# EasyEDA Pro project 0x2A.epro

# Schematic Schematic1
Create Date: 2023-12-21; Page Name: P1; Project Name: sensor_coil; Schematic Name: Schematic1; Update Date: 2024-07-09
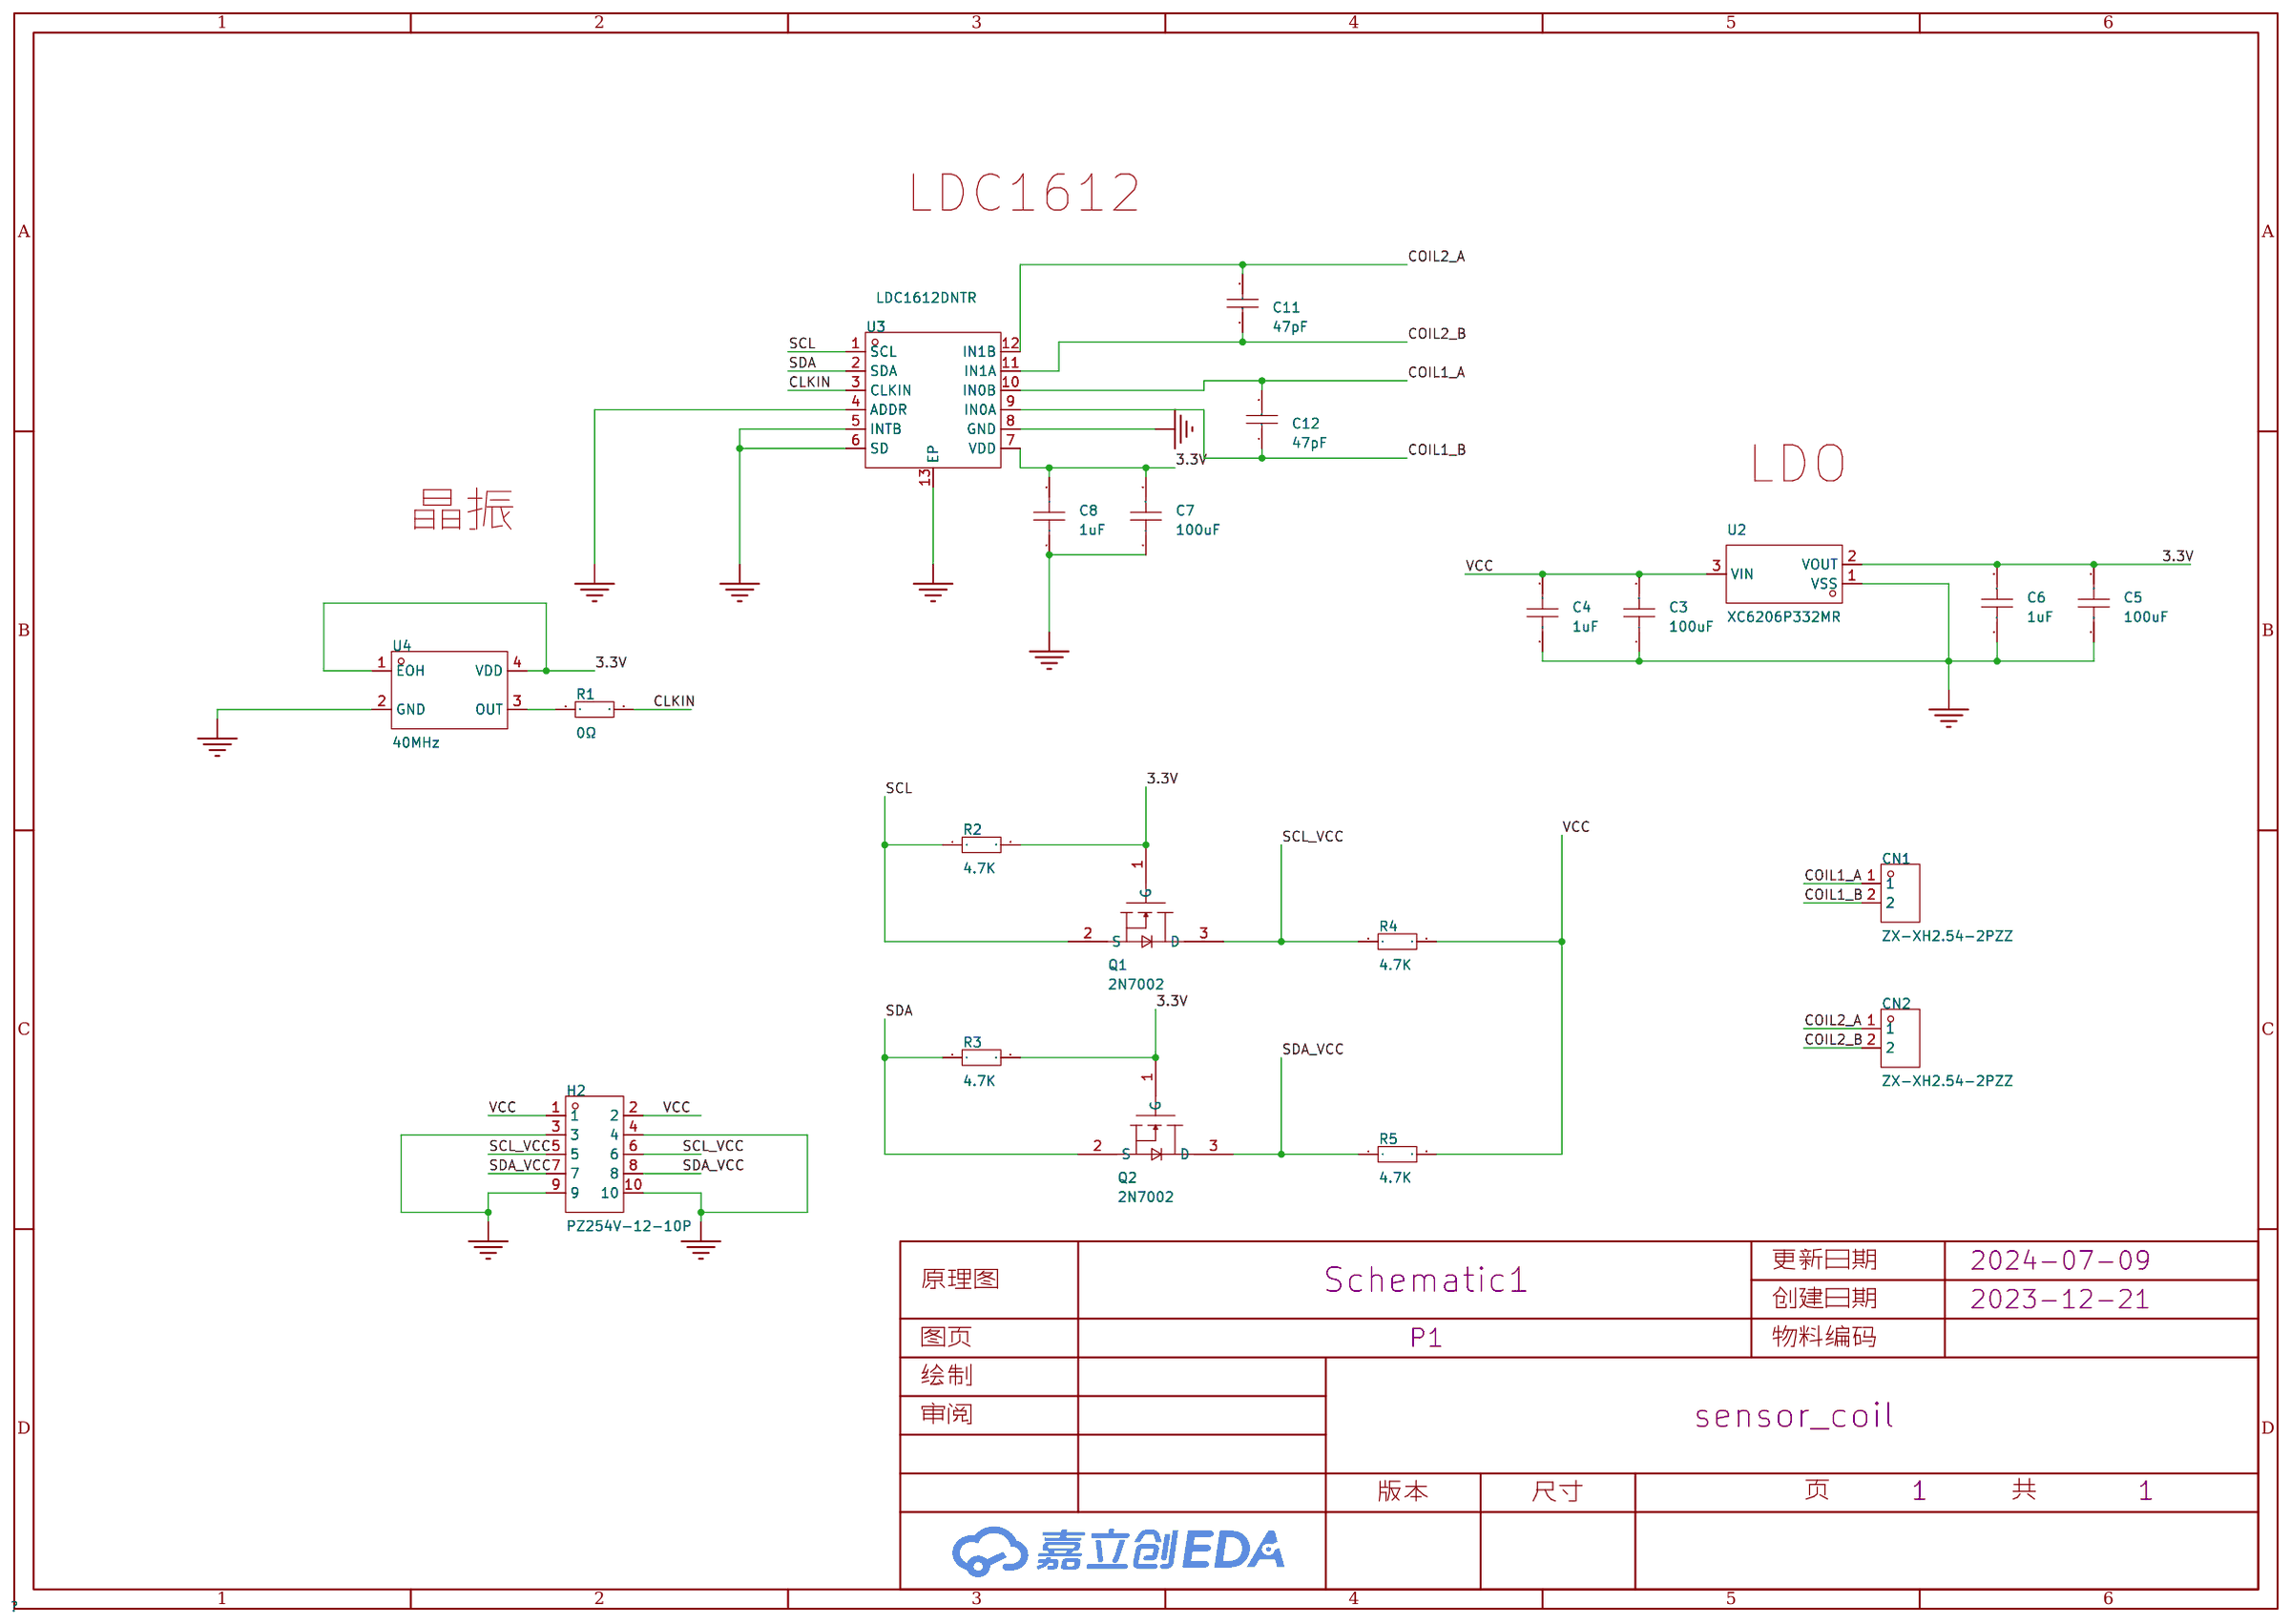
[diagram p0: schematic sheet]

## Parts
C3  100uF  [C0603]
C4  1uF  [C0603]
C5  100uF  [C0603]
C6  1uF  [C0603]
C7  100uF  [C0603]
C8  1uF  [C0603]
C11  47pF  [C0402]
C12  47pF  [C0402]
CN1  ZX-XH2.54-2PZZ  [CONN-TH_2P-P2.50_HX25003-2A]
CN2  ZX-XH2.54-2PZZ  [CONN-TH_2P-P2.50_HX25003-2A]
H2  PZ254V-12-10P  [HDR-TH_10P-P2.54-V-M-R2-C5-S2.54]
Q1  2N7002  [SOT-23-3_L2.9-W1.3-P1.90-LS2.4-BR]
Q2  2N7002  [SOT-23-3_L2.9-W1.3-P1.90-LS2.4-BR]
R1  0Ω  [R0603]
R2  4.7K  [R0603]
R3  4.7K  [R0603]
R4  4.7K  [R0603]
R5  4.7K  [R0603]
U2  XC6206P332MR  [SOT-23-3_L3.0-W1.7-P0.95-LS2.9-BR]
U3  LDC1612DNTR  [WSON-12_L4.0-W4.0-P0.50-BL-EP]
U4  40MHz  [OSC-SMD_4P-L2.5-W2.0-BL]

## Library data of the parts
C3-C8 = CAP_0603: Supplier Footprint: 0603
C11 C12 = 0402CG470J500NT: 容值:47pF;精度:±5%;额定电压:50V;材质(温度系数):C0G;; LCSC Part Name: 47pF ±5% 50V; Supplier Part: C1567; Manufacturer: FH(风华); Supplier Footprint: 0402; JLCPCB Part Class: 基础库; Datasheet: https://atta.szlcsc.com/upload/public/pdf/source/20200305/C486355_26A10D38EF8C2A5C37091D0039909270.pdf; Supplier: LCSC; Tolerance: ±5%; Voltage Rated: 50V; Temperature Coefficient: C0G
CN1 CN2 = ZX-XH2.54-2PZZ: 插针结构:1x2P;间距:2.54mm;安装方式:直插;参考系列:XH;总PIN数:2P;排数:1;每排PIN数:2;行距:-;额定电流:3A;触头材质:黄铜;触头镀层:锡;工作温度范围:-25℃~+85℃;; Supplier Part: C7429632; Manufacturer: Megastar(兆星); Supplier Footprint: 插件,P=2.54mm; JLCPCB Part Class: 扩展库; Datasheet: https://atta.szlcsc.com/upload/public/pdf/source/20230619/19BA6947230AA44A04D3EDD65E618FD0.pdf; Supplier: LCSC; Pins Structure: 1x2P; Pitch: 2.54mm; Mounting Style: 直插; Reference Series: XH; Number of Pins: 2P; Number of Rows: 1; Number of PINs Per Row: 2; Current Rating (Max): 3A; Contact Material: 黄铜; Contact Plating: 锡; Operating Temperature Range: -25℃~+85℃
H2 = PZ254V-12-10P: 插针结构:2x5P;间距:2.54mm;行距:2.54mm;圆针/方针:方针;安装类型:直插;排数:双排;总PIN位数:10P;额定电流:-;额定电压:-;配合针长度:6mm;塑高:2.5mm;端接针长度:3mm;触头材质:黄铜;触头镀层:-;工作温度范围:-40℃~+105℃;颜色:黑色;; LCSC Part Name: 间距:2.54mm 2x5P 直插 方针; Supplier Part: C492422; Manufacturer: XFCN(兴飞); Supplier Footprint: 插件,P=2.54mm; JLCPCB Part Class: 扩展库; Datasheet: https://atta.szlcsc.com/upload/public/pdf/source/20200309/C492422_5020CEA01BE7051F9EA9DD81AB0A25E3.pdf; Supplier: LCSC; Pin Structure: 2x5P; Pitch: 2.54mm; Row Spacing: 2.54mm; Circluar Pins/Square Pins: 方针; Mounting Type: 直插; Number of Rows: 双排; Number of Pins: 10P; Length of Mating Pin: 6mm; Insulation Height: 2.5mm; Length of End Connection Pin: 3mm; Contact Material: 黄铜; Operating Temperature Range: -40℃~+105℃; Color: 黑色
Q1 Q2 = 2N7002_C916396: 类型:N沟道;漏源电压(Vdss):60V;连续漏极电流(Id):115mA;功率(Pd):200mW;导通电阻(RDS(on)@Vgs,Id):1.2Ω@10V,500mA;阈值电压(Vgs(th)@Id):2.1V@250uA;; LCSC Part Name: N沟道 耐压:60V 电流:115mA; Supplier Part: C916396; Manufacturer: JSMSEMI(杰盛微); Supplier Footprint: SOT-23; JLCPCB Part Class: 扩展库; Datasheet: https://atta.szlcsc.com/upload/public/pdf/source/20230714/89F30C6A193AD72E5F1F14B53E304F4A.pdf; Supplier: LCSC; Type: N沟道; Drain Source Voltage (Vdss): 60V; Continuous Drain Current (Id): 115mA; Power Dissipation (Pd): 200mW; Drain Source On Resistance (RDS(on)@Vgs,Id): 1.2Ω@10V,500mA; Gate Threshold Voltage (Vgs(th)@Id): 2.1V@250uA; Input Capacitance (Ciss@Vds): 20pF@25V; Reverse Transfer Capacitance (Crss@Vds): 4pF@25V
R1-R5 = Res_0603: Supplier Footprint: 0603
U2 = XC6206P332MR_C347376: 输出类型:固定;最大输入电压:8V;输出电压:3.3V;最大输出电流:250mA;电源纹波抑制比(PSRR):40dB@(1kHz);输出极性:正极;; LCSC Part Name: 输入8V 输出3.3V 250mA; Supplier Part: C347376; Manufacturer: UMW(友台半导体); Supplier Footprint: SOT-23; JLCPCB Part Class: 扩展库; Datasheet: https://atta.szlcsc.com/upload/public/pdf/source/20231109/6B10DA60E52FC900BF97E3EFEB5D6341.pdf; Supplier: LCSC; Output Type: 固定; Maximum Input Voltage: 8V; Output Voltage: 3.3V; MAX Output Current: 250mA; Power Supply Rejection Ratio (PSRR): 40dB@(1kHz); Dropout Voltage: 240mV@(50mA); Operating Temperature: -25℃~+80℃; Output Polarity: 正极; Number of Outputs: 1
U3 = LDC1612DNTR: LDC1612 2 通道、28 位、高分辨率电感数字转换器; Supplier Part: C1847959; Manufacturer: TI(德州仪器); Supplier Footprint: WSON-12-EP(4x4); JLCPCB Part Class: 扩展库; Datasheet: https://www.ti.com/cn/lit/gpn/ldc1614; Supplier: LCSC
U4 = 625L3C040M00000: 频率:40MHz;输出模式:CMOS;工作电压:3.3V;供电电流:15mA;频率稳定度(全温):±50ppm;; Supplier Part: C2650709; Manufacturer: CTS(西迪斯); Supplier Footprint: SMD2520-4P; JLCPCB Part Class: 扩展库; Datasheet: https://atta.szlcsc.com/upload/public/pdf/source/20210610/B2972916CDAADDBBA22F3051322CA2A0.pdf; Supplier: LCSC; Output Type: CMOS; Supply Voltage: 3.3V; Supply Current (Max): 15mA; Frequency Stability(Full temperature range): ±50ppm; Operating Temperature: -20℃~+70℃

## Nets
3.3V: C5.2 C6.2 C7.2 C8.2 Q1.1(G) Q2.1(G) R2.2 R3.2 U2.2(VOUT) U3.7(VDD) U4.1(EOH) U4.4(VDD)
GND: C3.1 C4.1 C5.1 C6.1 C7.1 C8.1 H2.3 H2.4 H2.9 H2.10 U2.1(VSS) U3.4(ADDR) U3.5(INTB) U3.6(SD) U3.8(GND) U3.13(EP) U4.2(GND)
VCC: C3.2 C4.2 H2.1 H2.2 R4.2 R5.2 U2.3(VIN)
CLKIN: R1.2 U3.3(CLKIN)
COIL1_A: C12.2 CN1.1 U3.10(IN0B)
COIL1_B: C12.1 CN1.2 U3.9(IN0A)
COIL2_A: C11.2 CN2.1 U3.12(IN1B)
COIL2_B: C11.1 CN2.2 U3.11(IN1A)
SCL: Q1.2(S) R2.1 U3.1(SCL)
SCL_VCC: H2.5 H2.6 Q1.3(D) R4.1
SDA: Q2.2(S) R3.1 U3.2(SDA)
SDA_VCC: H2.7 H2.8 Q2.3(D) R5.1
$1N1491: R1.1 U4.3(OUT)

## Notes on the sheet
- LDC1612
- LDO
- 晶振

# Board PCB1
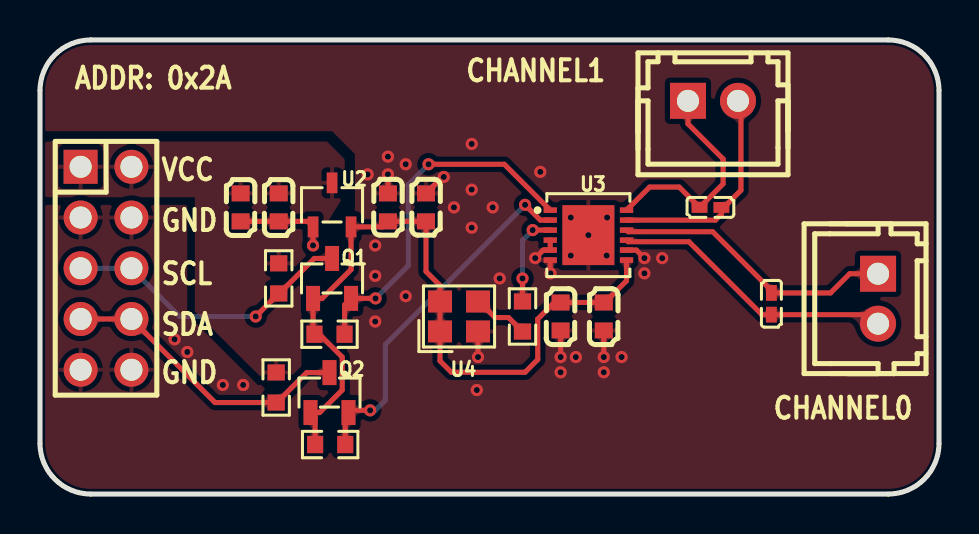
[diagram p1: board, top side]
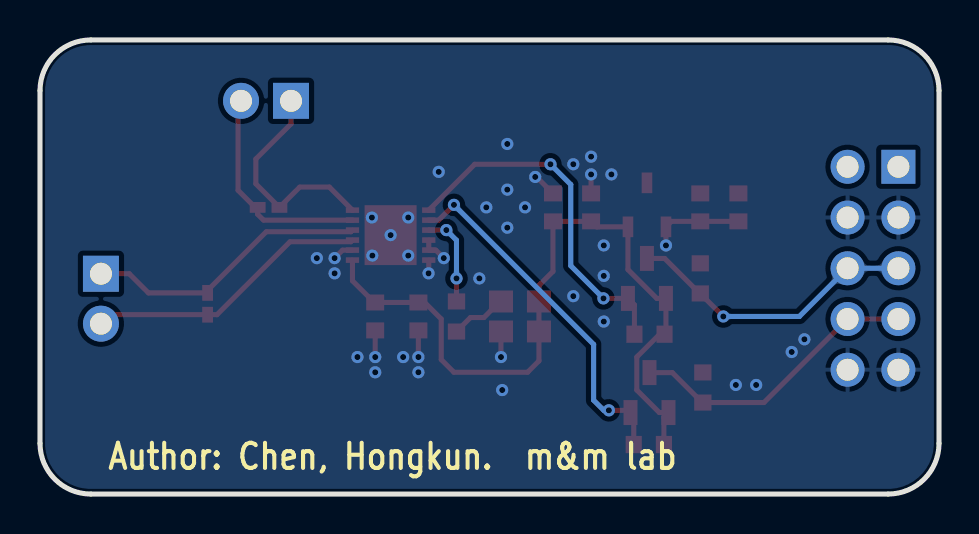
[diagram p2: board, bottom side, seen from below]

Outline 44.96 x 22.73 mm; copper layers: Top Layer, Bottom Layer. Coordinates in mm from the lower left corner of the outline.
Outline path: 0,20.19 0,2.54 arc(0.74,0.74) 2.54,0 42.42,0 arc(44.21,0.74) 44.96,2.54 44.96,20.19 arc(44.21,21.99) 42.42,22.73 2.54,22.73 arc(0.74,21.99) 0,20.19
Stack: Top Layer 0.035mm - / Dielectric1 1.51mm FR4 er 4.5 / Bottom Layer 0.035mm -

## Design rules (mm)
net SCL: DP3
net SDA: DP3
net COIL2_A: DP1
net COIL2_B: DP1
net COIL1_A: DP4
net COIL1_B: DP4
net SCL_VCC: DP2
net SDA_VCC: DP2
template: JLCPCB Capability(Two Layers Board)
spacing copperThickness1oz (default): track to track 0.102, other pairs 0.152 to 0.3
spacing copperThickness2oz: track to track 0.203, other pairs 0.152 to 0.3
track width copperThickness1oz (default): min 0.127, default 0.254, max 2.54
track width copperThickness2oz: min 0.203, default 0.254, max 2.54
differential pair differentialPair (default): width min 0.127, default 0.254, max 2.54; gap min 0.152, default 0.152
via viaSize (default): diameter min 0.5, default 0.61, max 10; hole min 0.3, default 0.305, max 6.3

## Placement (name value [footprint] x y rotation side)
C3  100uF  [C0603]  11.94 14.35 90 top
C4  1uF  [C0603]  10.03 14.35 90 top
C5  100uF  [C0603]  19.3 14.35 270 top
C6  1uF  [C0603]  17.4 14.35 270 top
C7  100uF  [C0603]  26.03 8.89 90 top
C8  1uF  [C0603]  28.19 8.89 90 top
C11  47pF  [C0402]  33.53 14.35 180 top
C12  47pF  [C0402]  36.58 9.53 90 top
CN1  ZX-XH2.54-2PZZ  [CONN-TH_2P-P2.50_HX25003-2A]  41.91 9.78 270 top
CN2  ZX-XH2.54-2PZZ  [CONN-TH_2P-P2.50_HX25003-2A]  33.66 19.69 0 top
H2  PZ254V-12-10P  [HDR-TH_10P-P2.54-V-M-R2-C5-S2.54]  3.3 11.3 270 top
Q1  2N7002  [SOT-23-3_L2.9-W1.3-P1.90-LS2.4-BR]  14.6 10.8 270 top
Q2  2N7002  [SOT-23-3_L2.9-W1.3-P1.90-LS2.4-BR]  14.48 5.08 270 top
R1  0Ω  [R0603]  24.13 8.89 90 top
R2  4.7K  [R0603]  14.48 8 180 top
R3  4.7K  [R0603]  14.51 2.48 180 top
R4  4.7K  [R0603]  11.94 10.8 90 top
R5  4.7K  [R0603]  11.81 5.33 90 top
U2  XC6206P332MR  [SOT-23-3_L3.0-W1.7-P0.95-LS2.9-BR]  14.6 14.48 270 top
U3  LDC1612DNTR  [WSON-12_L4.0-W4.0-P0.50-BL-EP]  27.42 12.96 270 top
U4  40MHz  [OSC-SMD_4P-L2.5-W2.0-BL]  20.96 8.89 0 top

## Footprints (pads in the part's own frame, mm; a bottom-side part is the same pattern mirrored in y, then rotated)
C0402
  rect 0.79x0.54 smd: 1(-0.545,0) 2(0.545,0)
C0603
  rect 0.8x0.9 smd: 1(-0.7,0) 2(0.7,0)
CONN-TH_2P-P2.50_HX25003-2A
  rect 1.8x1.8 hole 1.1: 1(-1.25,0)
  round 1.8 hole 1.1: 2(1.25,0)
HDR-TH_10P-P2.54-V-M-R2-C5-S2.54
  rect 1.7x1.7 hole 1.1: 1(-5.08,-1.27)
  round 1.7 hole 1.1: 2(-5.08,1.27) 3(-2.54,-1.27) 4(-2.54,1.27) 5(0,-1.27) 6(0,1.27) 7(2.54,-1.27) 8(2.54,1.27) 9(5.08,-1.27) 10(5.08,1.27)
OSC-SMD_4P-L2.5-W2.0-BL
  rect 1.2x1.1 smd: 1(-0.95,-0.75) 2(0.95,-0.75) 3(0.95,0.75) 4(-0.95,0.75)
R0603
  rect 0.806x0.864 smd: 1(-0.753,0) 2(0.753,0)
SOT-23-3_L2.9-W1.3-P1.90-LS2.4-BR
  rect 1.25x0.7 smd: 1(1,-0.95) 2(1,0.95) 3(-1,0)
SOT-23-3_L3.0-W1.7-P0.95-LS2.9-BR
  rect 1.038x0.532 smd: 1(1.101,-0.95) 2(1.101,0.95) 3(-1.101,0)
WSON-12_L4.0-W4.0-P0.50-BL-EP
  rect 0.28x0.665 smd: 1(-1.25,-1.907) 2(-0.75,-1.907) 3(-0.25,-1.907) 4(0.25,-1.907) 5(0.75,-1.907) 6(1.25,-1.907) 7(1.25,1.907) 8(0.75,1.907) 9(0.25,1.907) 10(-0.25,1.907) 11(-0.75,1.907) 12(-1.25,1.907)
  rect 3x2.6 smd: 13(0,0)

## Nets
As in the schematic.

## Via types
v1: diameter 0.61, hole 0.305, Top Layer to Bottom Layer, 46 vias

## Routing (per net, layer and track width the routed paths; a pad name or vN(x,y) marks a point on that pad's centre or on a via; arc(x,y) is an arc through that point)
3.3V: length 38.5
  Top Layer w0.254: R3.2 13.76,3.85 Q2.1 13.99,4.08 15.11,5.21 15.11,6.86 13.97,8 R2.2 13.66,8.07 Q1.1 14.11,9.8 15.56,11.24 U2.2 17.12,13.38 C6.2 C5.2 19.3,11.15 20,10.44 U4.4 U4.1 20,6.67 20.57,6.1 24.26,6.1 24.89,6.73 24.89,8.76 25.72,9.59 C7.2 C8.2 28.24,9.59 29.33,10.68 U3.7
GND: length 13.9
  Top Layer w0.254: v1(30.23,11.81) 29.83,12.21 U3.8 ; C4.1 C3.1 13.38,13.65 U2.1 v1(13.66,12.45) ; C5.1 20.13,15.88 v1(20.19,15.88) ; v1(25.53,11.05) 25.52,11.06 U3.6 ; v1(24.77,11.81) 25.17,12.21 U3.5 U3.4 ; C8.1 v1(28.19,6.86) ; C6.1 v1(17.4,16) ; C7.1 v1(26.03,6.86) ; U4.2 v1(21.91,6.86)
  vias: v1(6.73,7.75) v1(7.37,7.11) v1(9.14,5.46) v1(10.16,5.46) v1(16.38,16) v1(16.76,12.45) v1(16.76,10.92) v1(16.76,8.64) v1(17.4,16.89) v1(18.29,16.51) v1(18.29,9.91) v1(20.7,14.35) v1(21.59,17.53) v1(21.59,15.24) v1(21.59,13.34) v1(21.84,5.21) v1(22.64,14.35) v1(22.99,10.8) v1(25.02,16.13) v1(26.03,6.1) v1(26.54,13.84) v1(26.54,11.94) v1(26.8,6.86) v1(27.42,12.96) v1(28.19,6.1) v1(28.34,11.94) v1(28.36,13.84) v1(29.08,6.86) v1(30.23,11.05) v1(31.12,11.81)
CLKIN: length 4.7
  Top Layer w0.254: U3.3 25.51,13.22 v1(24.64,13.22) ; v1(24.13,10.8) R1.2
  Bottom Layer w0.254: v1(24.64,13.22) 24.13,12.71 v1(24.13,10.8)
COIL1_A: length 14.4
  Top Layer w0.254: CN1.1 40.49,11.03 39.53,10.07 C12.2 36.58,10.2 33.64,13.13 29.41,13.13 U3.10
COIL1_B: length 14.3
  Top Layer w0.254: U3.9 29.41,12.63 32.45,12.63 36.1,8.98 C12.1 41.46,8.98 CN1.2
COIL2_A: length 11.1
  Top Layer w0.254: U3.12 30.49,15.37 31.97,15.37 C11.2 34.16,15.53 34.16,16.77 32.41,18.53 CN2.1
COIL2_B: length 11.1
  Top Layer w0.254: CN2.2 35.05,19.54 35.05,15.2 34.2,14.35 34.07,14.35 34.07,14.01 33.78,13.71 U3.11
SCL: length 18
  Top Layer w0.254: v1(19.43,16.51) 23.22,16.51 U3.1 ; R2.1 15.23,9.47 Q1.2 v1(16.78,9.8)
  Bottom Layer w0.254: v1(16.78,9.8) 18.41,11.43 18.41,15.49 v1(19.43,16.51)
SCL_VCC: length 14.8
  Top Layer w0.254: v1(10.79,8.89) R4.1 11.97,10.04 13.72,11.8 Q1.3
  Bottom Layer w0.254: v1(10.79,8.89) 6.99,8.89 H2.6 H2.5
SDA: length 18
  Top Layer w0.254: R3.1 15.26,3.92 Q2.2 15.54,4.19 v1(16.51,4.19) ; U3.2 25.02,13.71 v1(24.26,14.48)
  Bottom Layer w0.254: v1(16.51,4.19) 16.76,4.19 17.27,4.7 17.27,7.49 v1(24.26,14.48)
SDA_VCC: length 14.8
  Top Layer w0.254: Q2.3 13.34,6.08 11.84,4.58 R5.1 8.75,4.58 H2.8 H2.7
$1N1491: length 2.8
  Top Layer w0.254: U4.3 21.96,9.64 22.76,8.84 23.43,8.84 R1.1

## Copper pours and planes (outline as drawn; the poured copper is in the pictures)
GND on Top Layer: -0.76,18.16 14.6,18.16 15.75,17.02 15.75,14.31 13.34,11.9 13.34,6.39 12.41,5.46 10.9,5.46 7.37,8.99 7.37,14.48 -1.4,14.48 -1.4,-0.51 46.35,-0.51 46.35,23.37 -0.76,23.37
GND on Bottom Layer: -4.57,24.64 51.94,24.64 51.94,-2.79 -4.57,-2.79
VCC on Top Layer: 0.25,17.65 14.35,17.65 15.24,16.76 15.24,15 13.08,11.52 13.08,6.4 12.21,5.54 11.36,5.54 7.75,9.14 7.75,14.86 0.25,14.86

Small or netless copper shapes (teardrops, artwork), in the pictures only: 87 on Top Layer, 10 on Bottom Layer

## Text on the board
Bottom Silkscreen Layer: Author: Chen, Hongkun.  m&m lab
Top Silkscreen Layer: ADDR: 0x2A | SCL | SDA | GND | CHANNEL1 | CHANNEL0 | VCC
